# EasyEDA Pro project fm33fk5410_Topaz_v1.2.epro, schematic Schematic6

## Sheets
1 core: Board Name: core_3; Create Date: 2025-07-03; Page Name: core; Project Name: fm33; Schematic Name: Schematic6; Update Date: 2025-07-19; Company: 嘉立创EDA; Page Size: A4; Version: V1.0
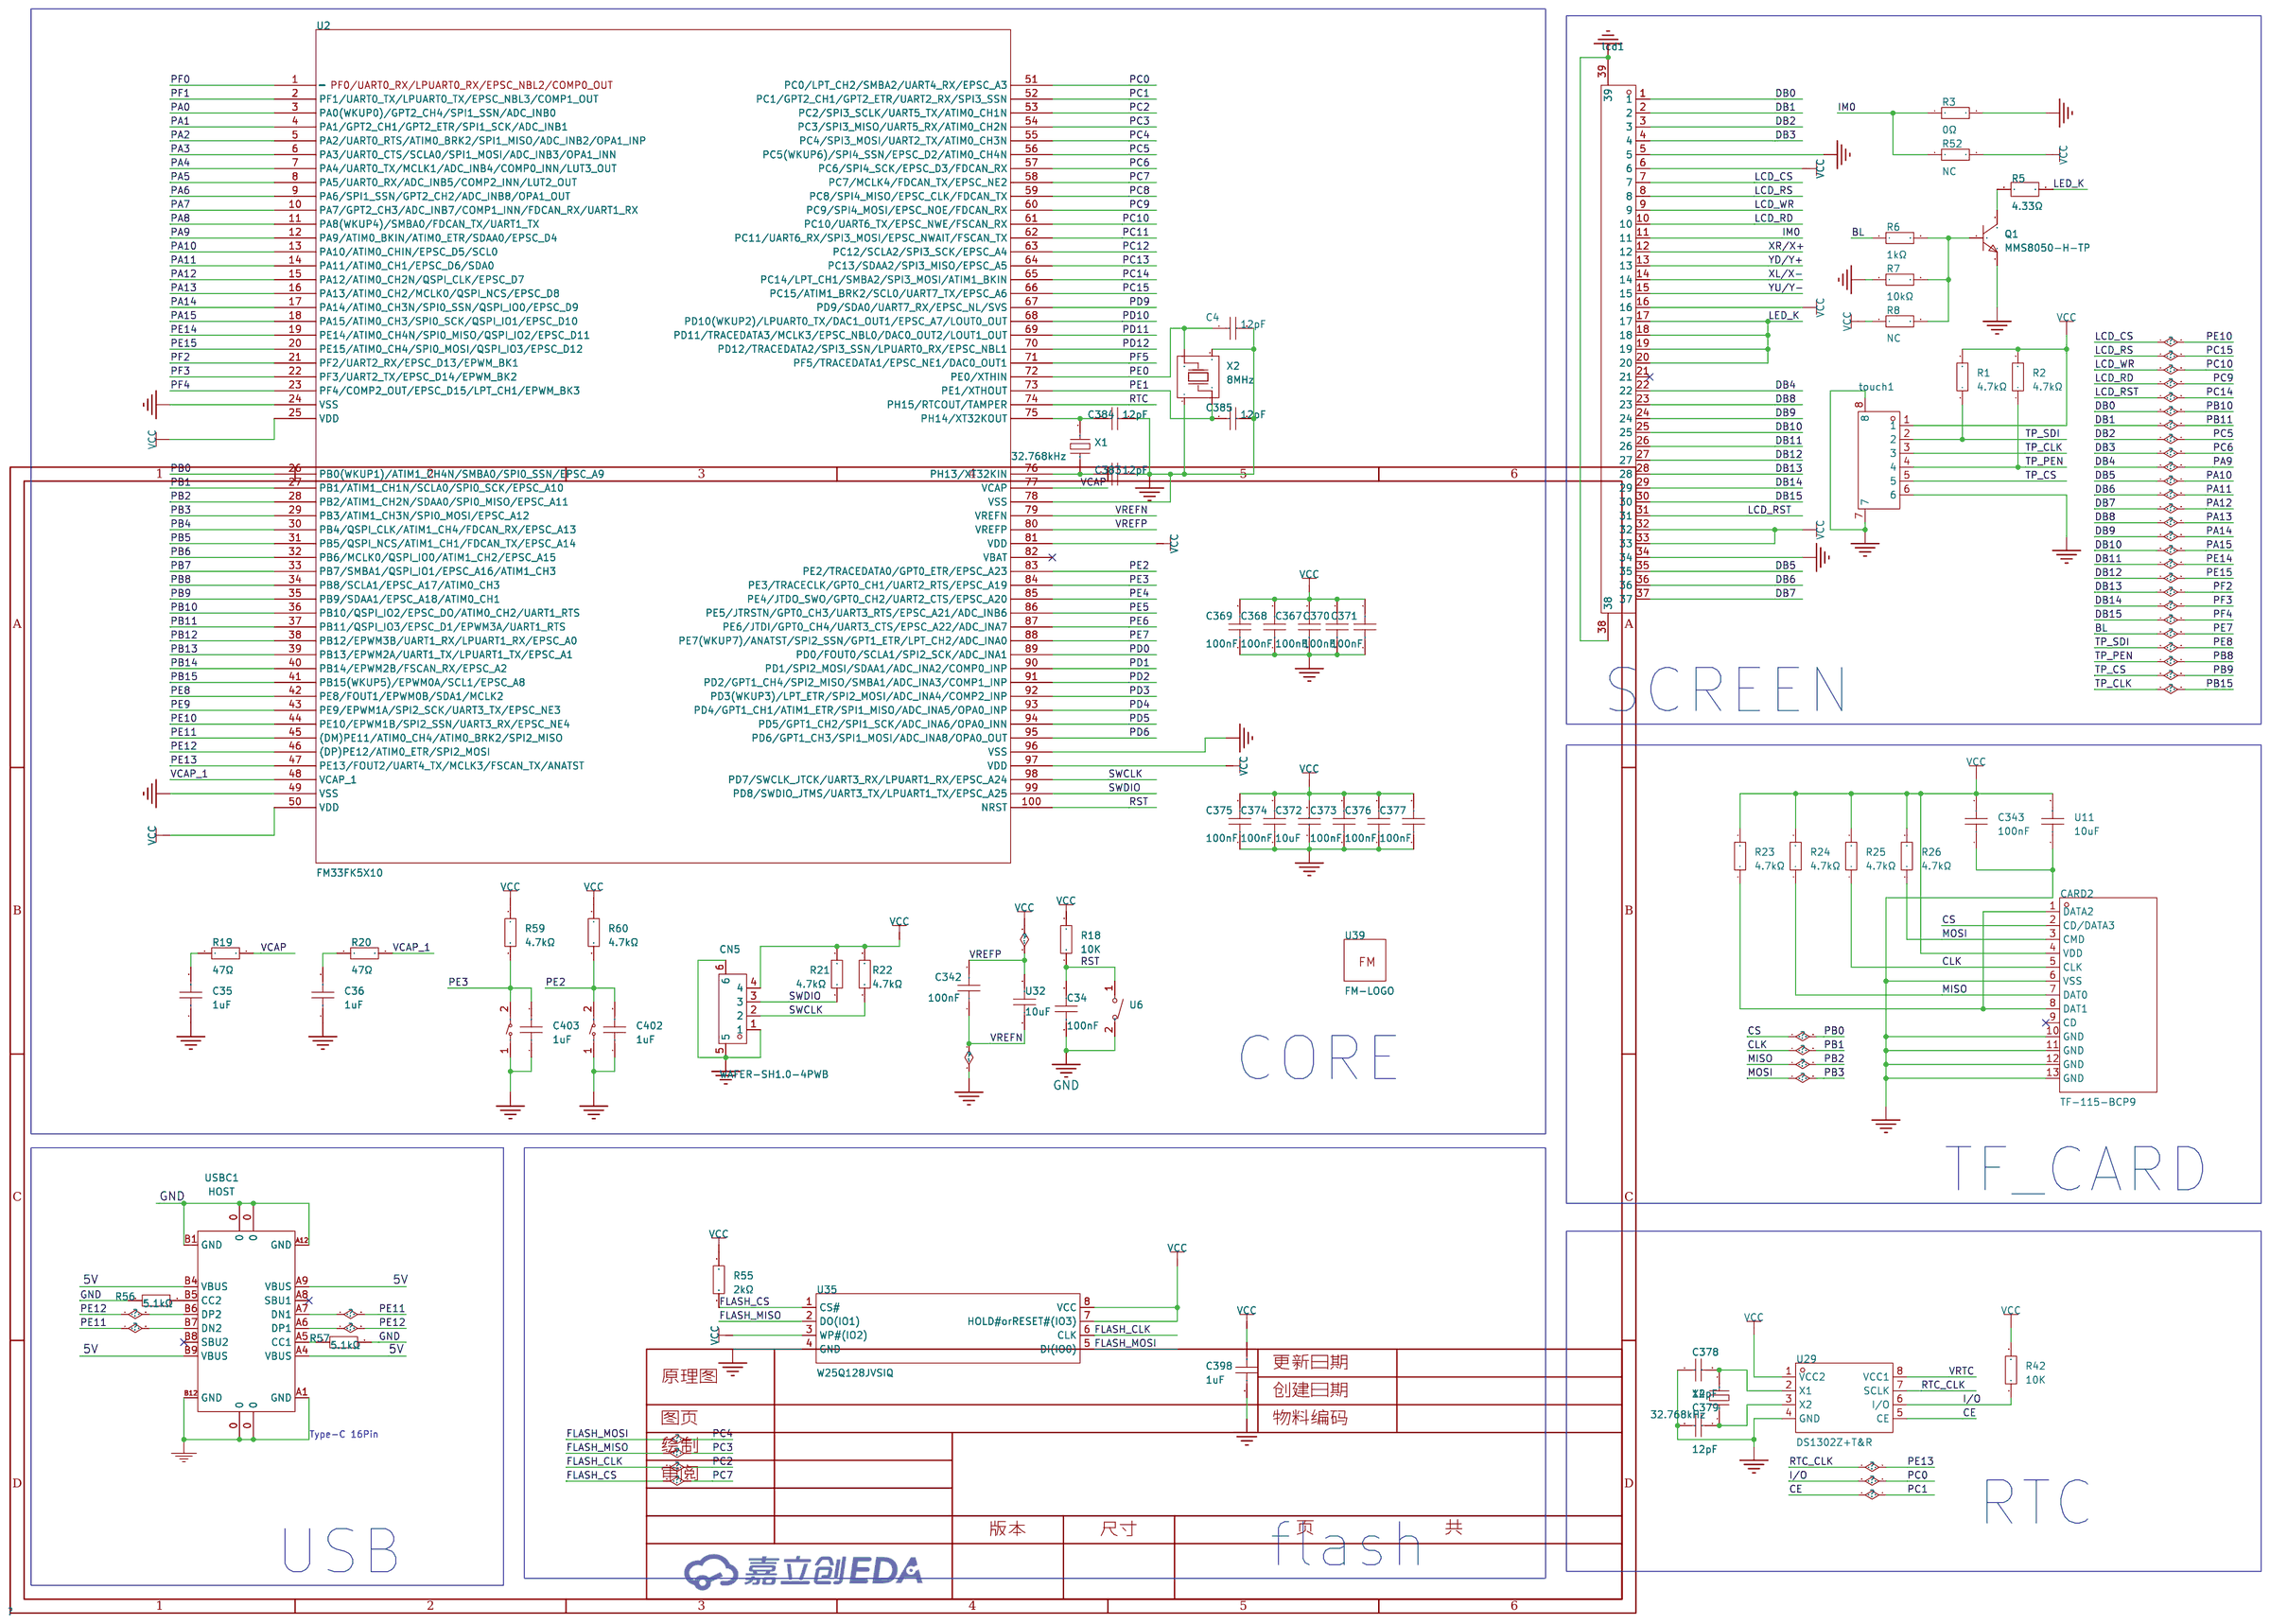
[diagram p0: core]
2 power: Create Date: 2025-07-15; Page Name: power; Update Date: 2025-07-18
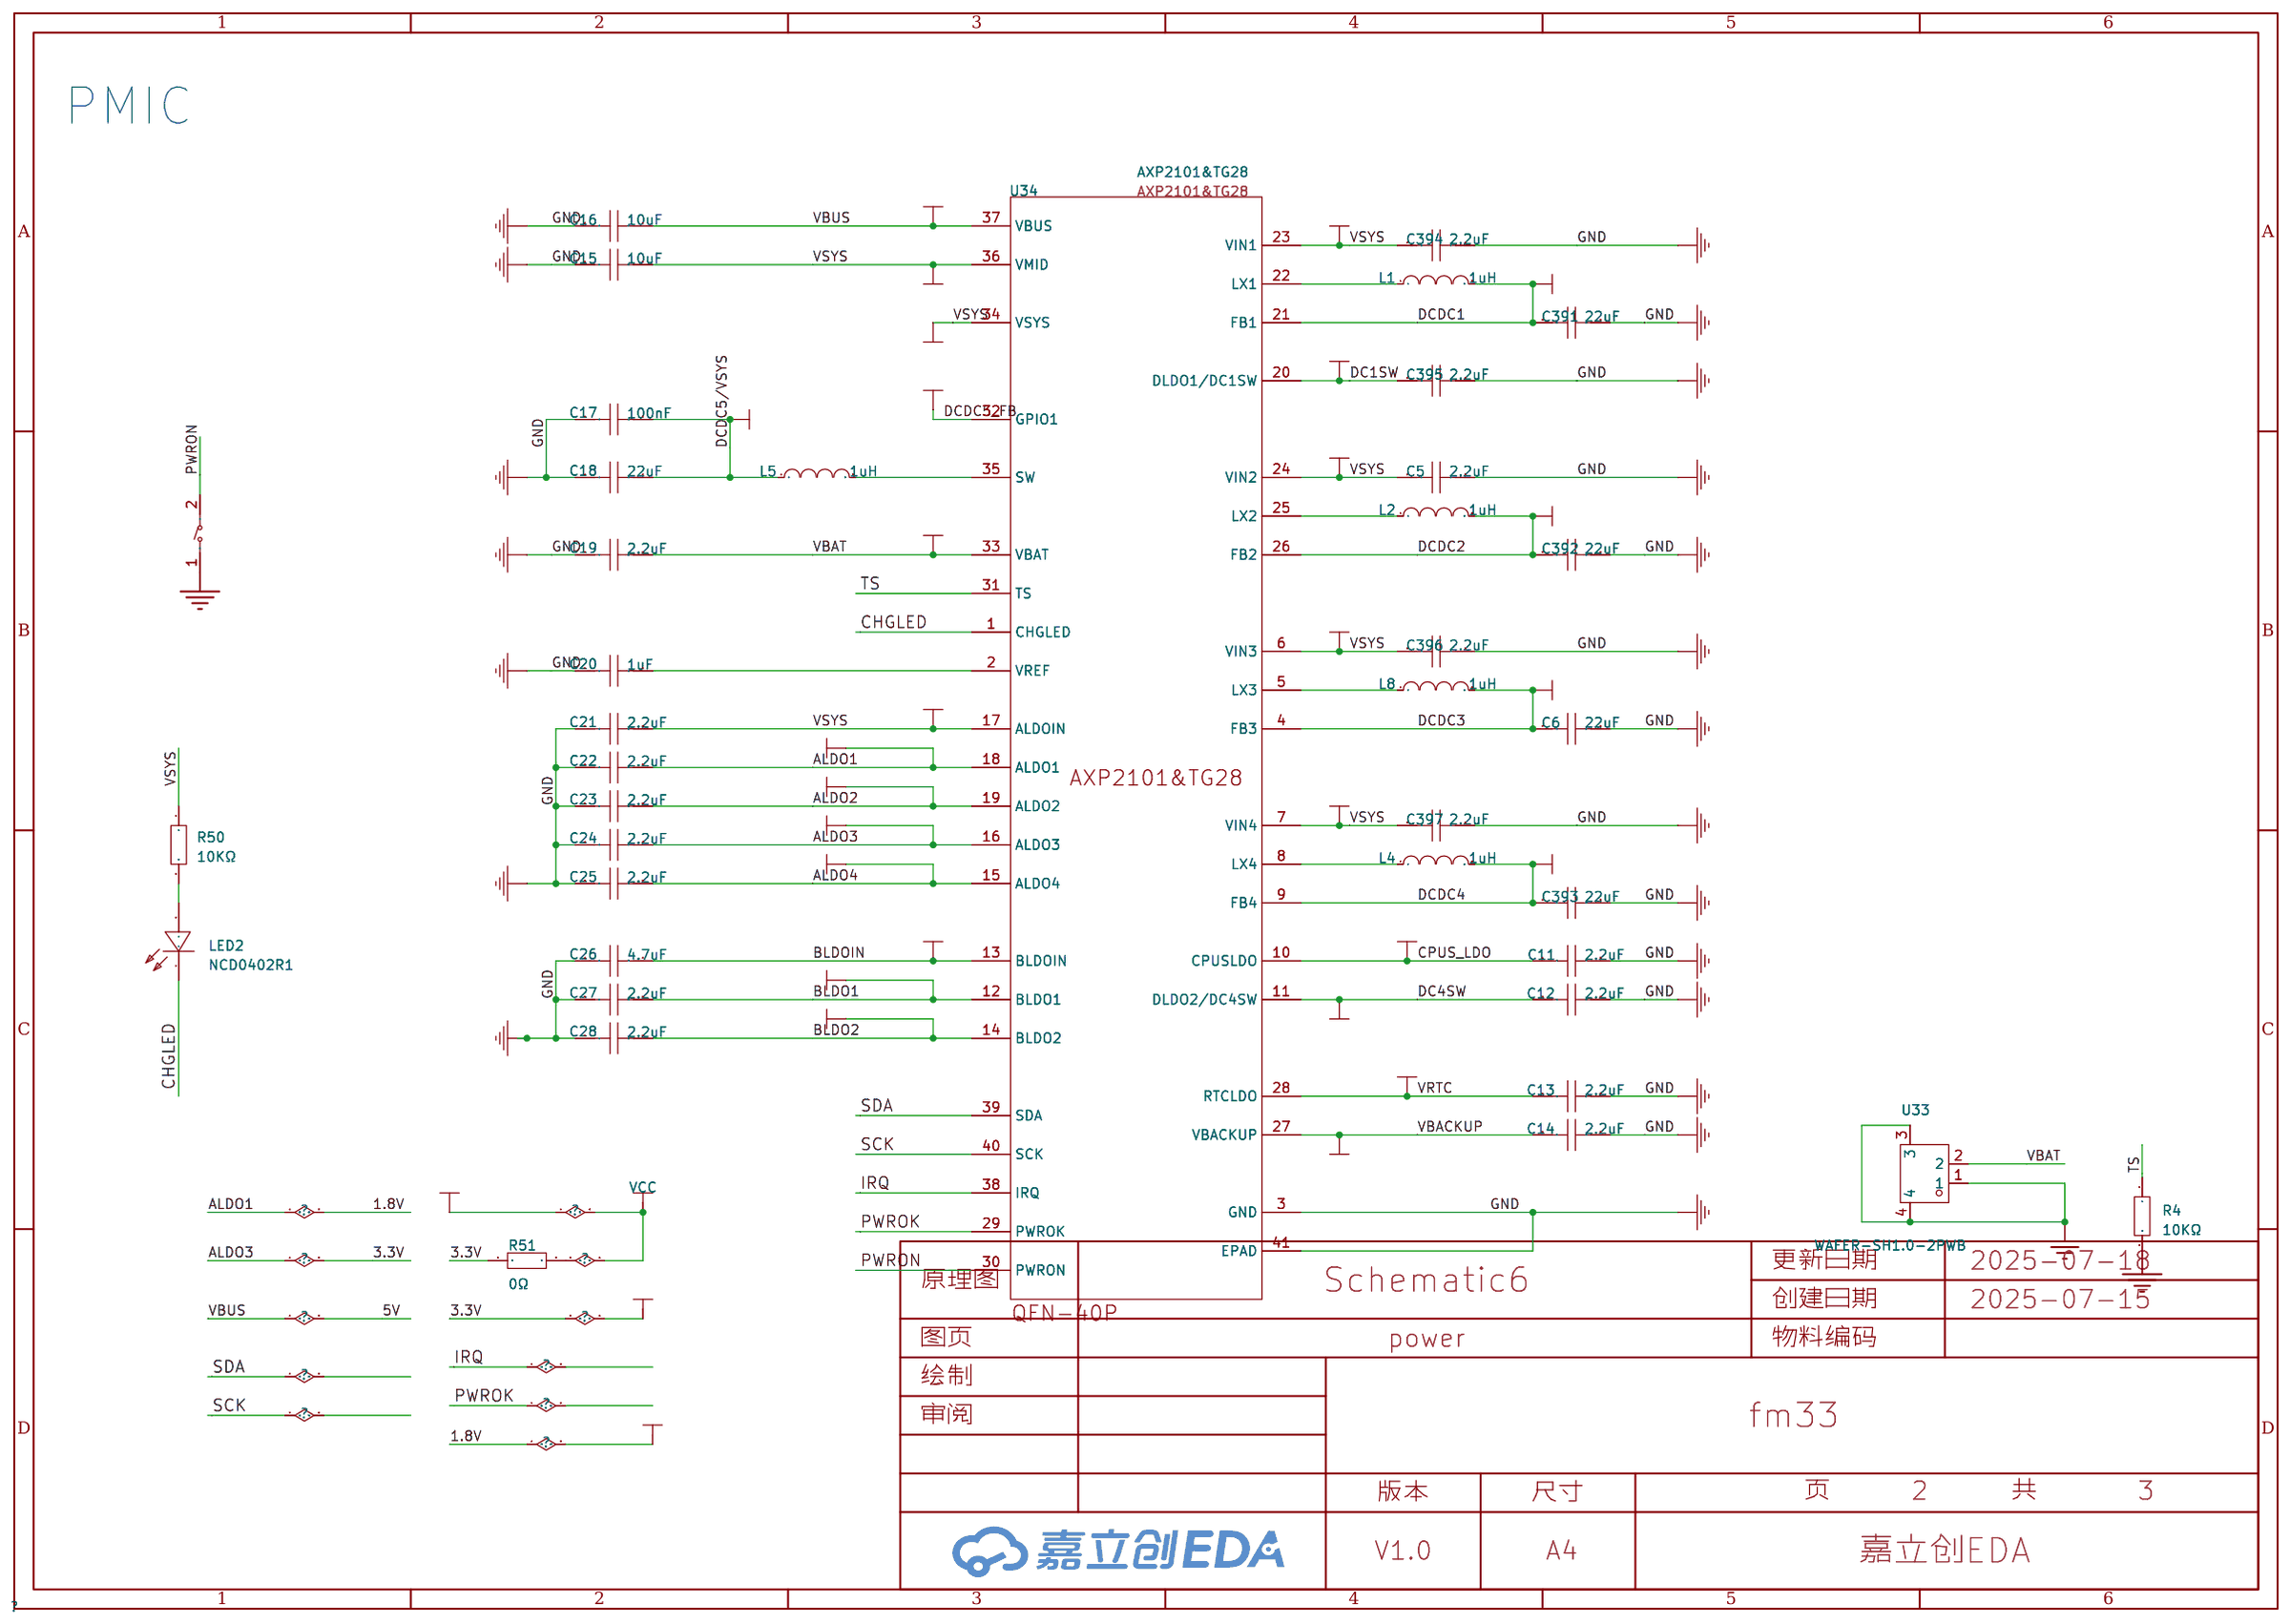
[diagram p1: power]
3 wav_decoder: Create Date: 2025-07-15; Page Name: wav_decoder
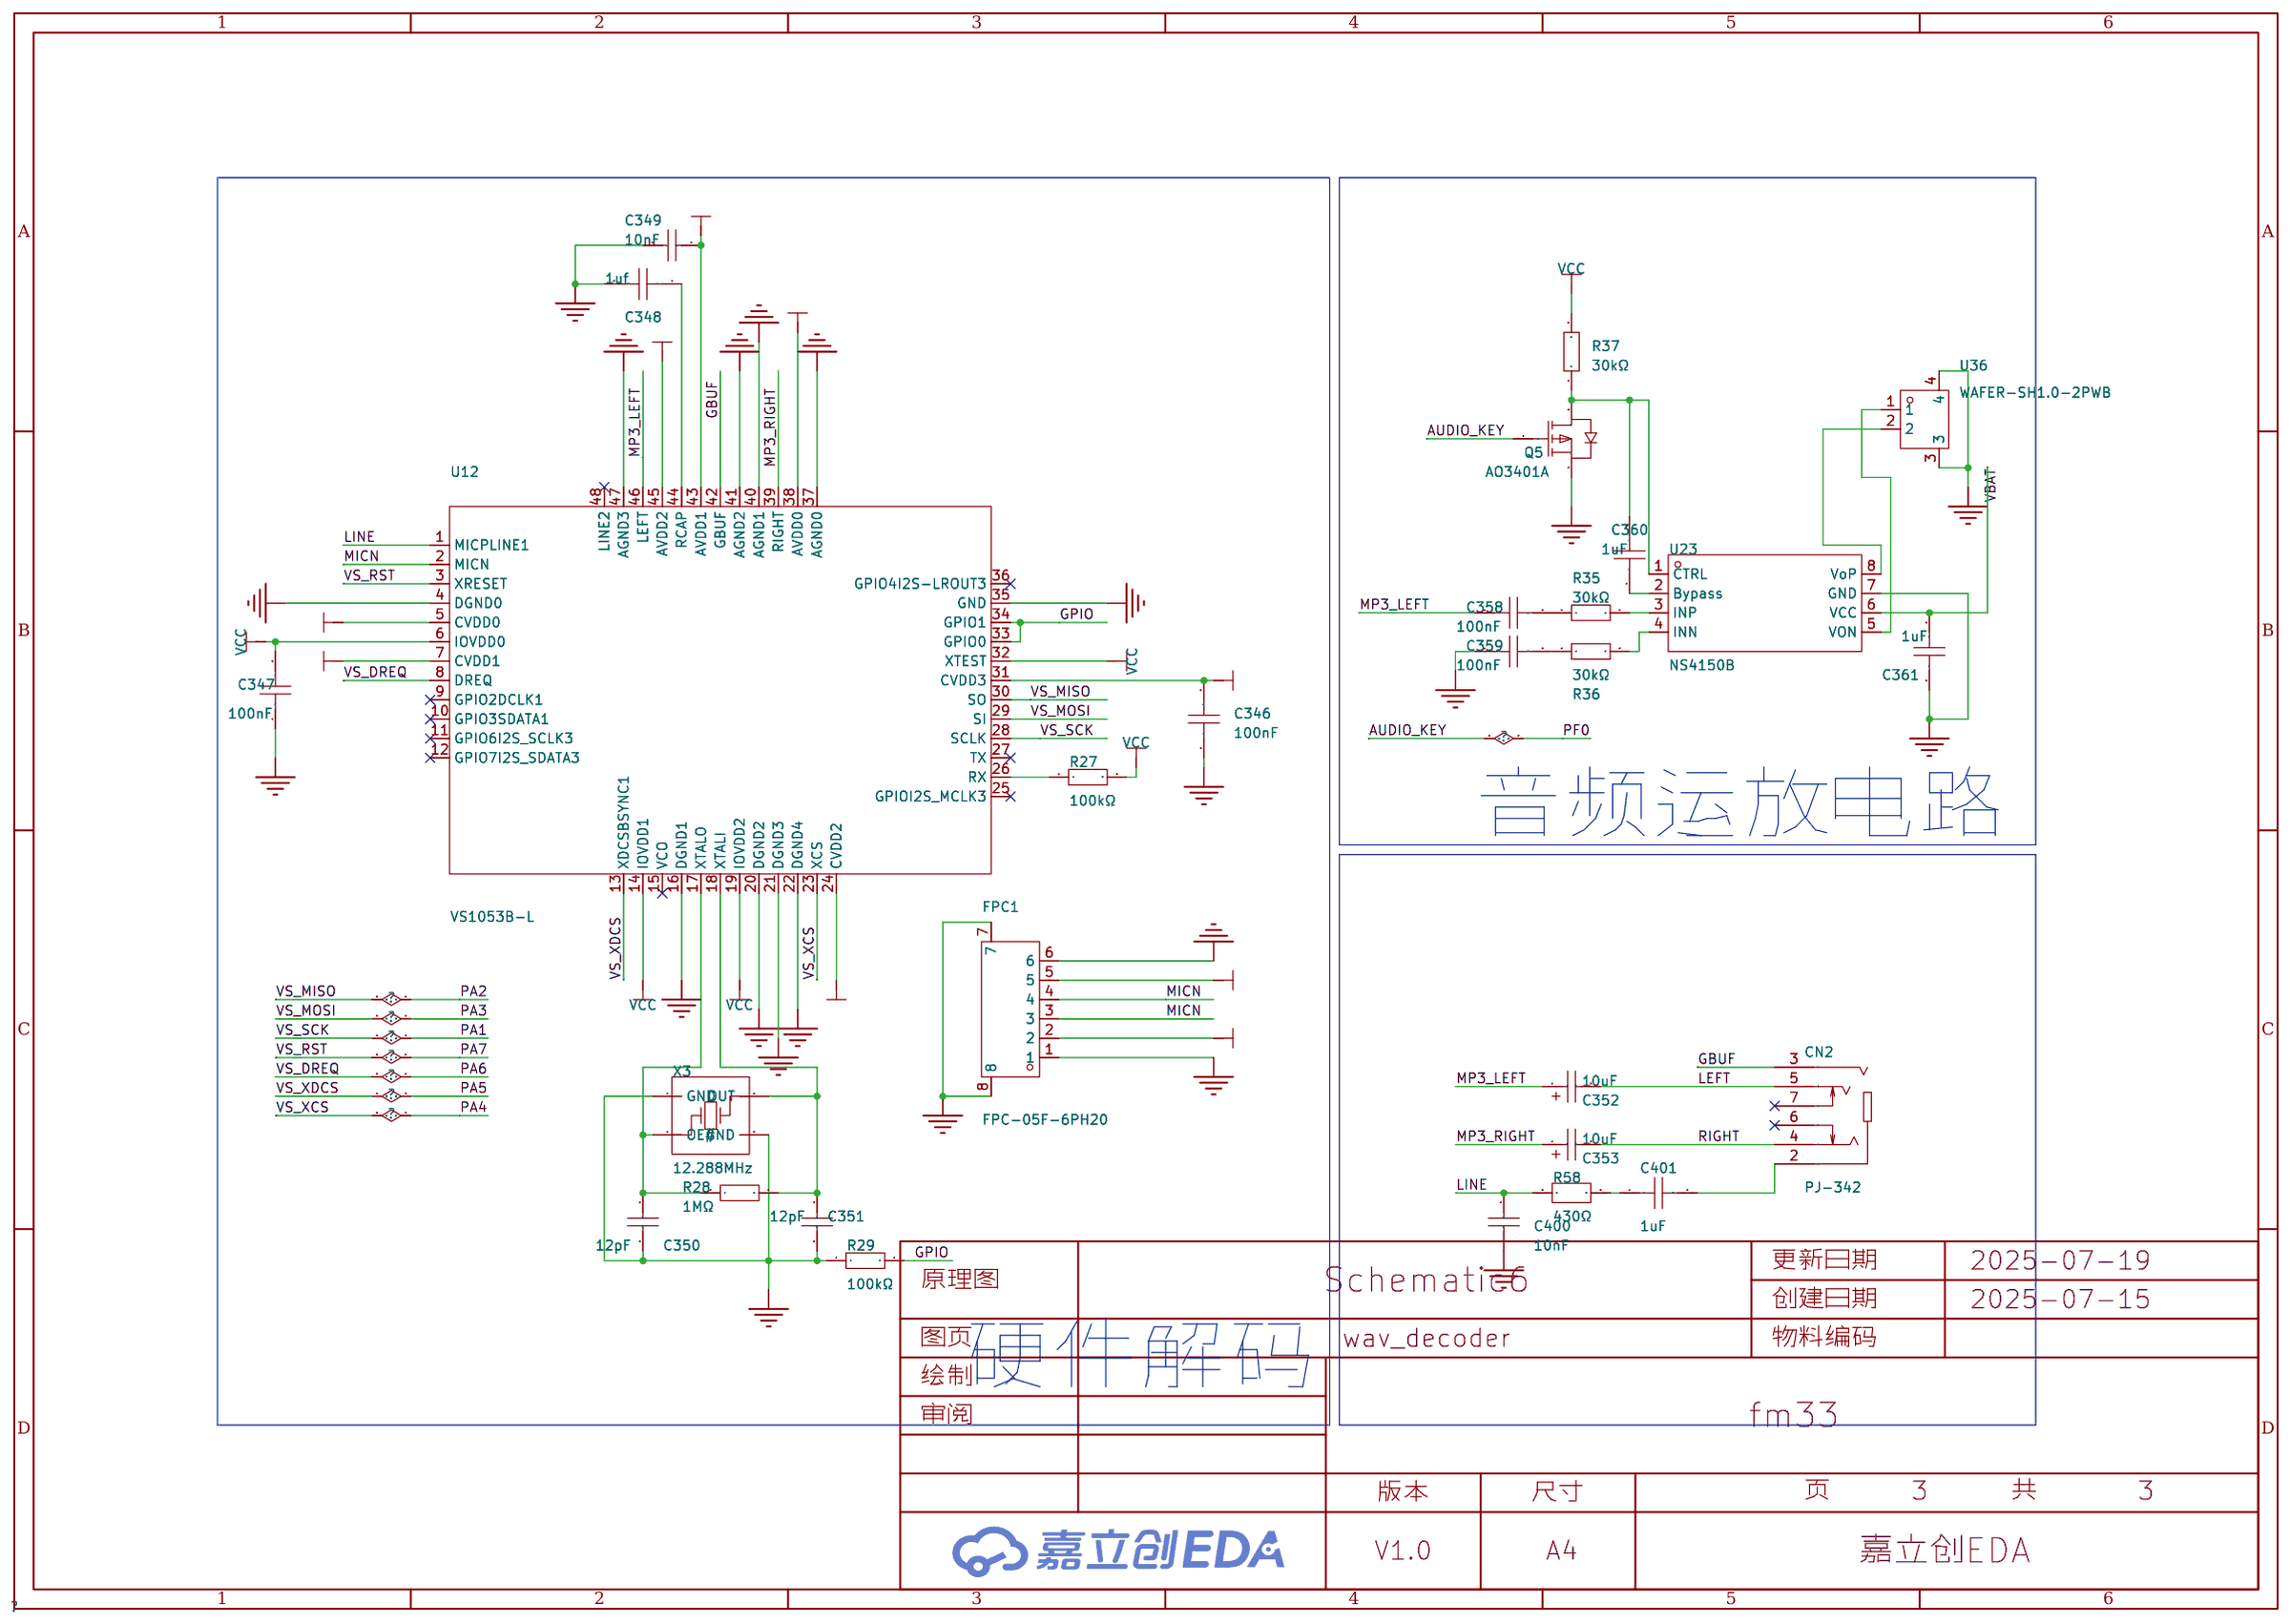
[diagram p2: wav_decoder]

## Parts
sheet core
C4  12pF  [C0402-NSK]
C34  100nF  [C0402-NSK]
C35  1uF  [C0402-NSK]
C36  1uF  [C0402-NSK]
C342  100nF  [C0402-NSK]
C343  100nF  [C0402-NSK]
C367  100nF  [C0402-NSK]
C368  100nF  [C0402-NSK]
C369  100nF  [C0402-NSK]
C370  100nF  [C0402-NSK]
C371  100nF  [C0402-NSK]
C372  10uF  [C0402-NSK]
C373  100nF  [C0402-NSK]
C374  100nF  [C0402-NSK]
C375  100nF  [C0402-NSK]
C376  100nF  [C0402-NSK]
C377  100nF  [C0402-NSK]
C378  12pF  [C0402-NSK]
C379  12pF  [C0402-NSK]
C383  12pF  [C0402-NSK]
C384  12pF  [C0402-NSK]
C385  12pF  [C0402-NSK]
C398  1uF  [C0603 NSK]
C402  1uF  [C0402-NSK]
C403  1uF  [C0402-NSK]
CARD2  TF-115-BCP9  [TF-SMD_TF-115-BCP9]
CN5  WAFER-SH1.0-4PWB  [CONN-SMD_4P-P1.00_WAFER-SH1.0-4PWB]
lcd1  KH-FG0.5-H2.0-37PIN  [FPC-SMD_37P-P0.50_KINGHELM_KH-FG0.5-H2.0-37PIN]
Q1  MMS8050-H-TP  [SOT-23-3_L2.9-W1.3-P1.90-LS2.4-BR]
R1  4.7kΩ  [R0402]
R2  4.7kΩ  [R0402]
R3  0Ω  [R0402]
R5  4.33Ω  [C0603]
R6  1kΩ  [R0402]
R7  10kΩ  [R0402]
R8  NC  [R0402]
R18  10K  [R0402]
R19  47Ω  [R0402]
R20  47Ω  [R0402]
R21  4.7kΩ  [R0402]
R22  4.7kΩ  [R0402]
R23  4.7kΩ  [R0402]
R24  4.7kΩ  [R0402]
R25  4.7kΩ  [R0402]
R26  4.7kΩ  [R0402]
R42  10K  [R0402]
R52  NC  [R0402]
R55  2kΩ  [R0402]
R56  5.1kΩ  [R0402]
R57  5.1kΩ  [R0402]
R59  4.7kΩ  [R0402]
R60  4.7kΩ  [R0402]
touch1  FPC-05F-6PH20  [FPC-SMD_6P-P0.50_XUNPU_FPC-05F-6PH20]
U2  FM33FK5X10  [LQFP100]
U6  TS2306A 200gf 002  [SW-SMD_L3.0-W2.0-LS3.5]
U11  10uF  [C0402-NSK]
U29  DS1302Z+T&R  [SOIC-8_L4.9-W3.9-P1.27-LS6.0-BL]
U32  10uF  [C0402-NSK]
U35  W25Q128JVSIQ  [SOIC-8_L5.3-W5.3-P1.27-LS8.0-BL]
U37  THAF09-AC-R  [KEY-SMD_L3.9-W2.9-P4.6-LS5.0-W3.6-EH]
U38  THAF09-AC-R  [KEY-SMD_L3.9-W2.9-P4.6-LS5.0-W3.6-EH]
U39  FM-LOGO  [FM-LOGO]
USBC1  HOST  [USB-TYPE-C_16PIN-MALE-TYPE-C-31-M-12]
X1  32.768kHz  [OSC-SMD_L3.2-W1.5]
X2  8MHz  [CRYSTAL-SMD_4P-L3.2-W2.5-BL]
X4  32.768kHz  [OSC-SMD_L3.2-W1.5]
sheet power
C5  2.2uF  [C0603]
C6  22uF  [C0603]
C11  2.2uF  [C0603]
C12  2.2uF  [C0603]
C13  2.2uF  [C0603]
C14  2.2uF  [C0603]
C15  10uF  [C0603]
C16  10uF  [C0603]
C17  100nF  [C0603]
C18  22uF  [C0603]
C19  2.2uF  [C0603]
C20  1uF  [C0603]
C21  2.2uF  [C0603]
C22  2.2uF  [C0603]
C23  2.2uF  [C0603]
C24  2.2uF  [C0603]
C25  2.2uF  [C0603]
C26  4.7uF  [C0603]
C27  2.2uF  [C0603]
C28  2.2uF  [C0603]
C391  22uF  [C0603]
C392  22uF  [C0603]
C393  22uF  [C0603]
C394  2.2uF  [C0603]
C395  2.2uF  [C0603]
C396  2.2uF  [C0603]
C397  2.2uF  [C0603]
L1  1uH  [L0806]
L2  1uH  [L0806]
L4  1uH  [L0806]
L5  1uH  [L0806]
L8  1uH  [L0806]
LED2  NCD0402R1  [LED0402-RD]
R4  10KΩ  [R0402]
R50  10KΩ  [R0402]
R51  0Ω  [C0603 NSK]
U10  THAF09-AC-R  [KEY-SMD_L3.9-W2.9-P4.6-LS5.0-W3.6-EH]
U33  WAFER-SH1.0-2PWB  [CONN-SMD_2P-P1.00_XUNPU_WAFER-SH1.0-2PWB]
U34  AXP2101&TG28  [QFN-40_L5.0-W5.0-P0.40-TL-EP3.4]
sheet wav_decoder
C346  100nF  [C0402-NSK]
C347  100nF  [C0402-NSK]
C348  1uf  [C0402-NSK]
C349  10nF  [C0402-NSK]
C350  12pF  [C0402-NSK]
C351  12pF  [C0402-NSK]
C352  10uF  [CAP-SMD_L3.2-W1.6-RD-C7171]
C353  10uF  [CAP-SMD_L3.2-W1.6-RD-C7171]
C358  100nF  [C0402-NSK]
C359  100nF  [C0402-NSK]
C360  1uF  [C0402-NSK]
C361  1uF  [C0402-NSK]
C400  10nF  [C0402-NSK]
C401  1uF  [C0402-NSK]
CN2  PJ-342  [AUDIO-SMD_PJ-342]
FPC1  FPC-05F-6PH20  [FPC-SMD_6P-P0.50_XUNPU_FPC-05F-6PH20]
Q5  AO3401A  [SOT-23_L2.9-W1.3-P1.90-LS2.4-BR]
R27  100kΩ  [R0402]
R28  1MΩ  [R0402]
R29  100kΩ  [R0402]
R35  30kΩ  [R0402]
R36  30kΩ  [R0402]
R37  30kΩ  [R0402]
R58  430Ω  [R0402]
U12  VS1053B-L  [LQFP-48_L7.0-W7.0-P0.50-LS9.0-BL]
U23  NS4150B  [MSOP-8_L3.0-W3.0-P0.65-LS5.0-BL]
U36  WAFER-SH1.0-2PWB  [CONN-SMD_2P-P1.00_XUNPU_WAFER-SH1.0-2PWB]
X3  12.288MHz  [CRYSTAL-SMD_4P-L3.2-W2.5-BL-2]

## Library data of the parts
C4 C350 C351 C378 C379 C383-C385 = GRM1555C1H120JA01D: 容值:12pF;精度:±5%;额定电压:50V;材质(温度系数):C0G;; LCSC Part Name: 12pF ±5% 50V; Supplier Part: C76948; Manufacturer: muRata(村田); Supplier Footprint: 0402; JLCPCB Part Class: 扩展库; Datasheet: https://atta.szlcsc.com/upload/public/pdf/source/20180307/C76948_15204091175261407736.pdf; Supplier: LCSC; Tolerance: ±5%; Voltage Rated: 50V; Temperature Coefficient: C0G
C34 C346-C348 = CAP_0402: Supplier Footprint: 0402
C35 C36 C360 C361 C401-C403 = CL05A105KA5NQNC: 容值:1uF;精度:±10%;额定电压:25V;材质(温度系数):X5R;; LCSC Part Name: 1uF ±10% 25V; Supplier Part: C52923; Manufacturer: SAMSUNG(三星); Supplier Footprint: 0402; JLCPCB Part Class: 基础库; Datasheet: https://atta.szlcsc.com/upload/public/pdf/source/20160218/1457707763339.pdf; Supplier: LCSC; Tolerance: ±10%; Voltage Rated: 25V; Temperature Coefficient: X5R
C342 C343 C358 C359 C367-C371 C373-C377 = CL05B104KB54PNC: 容值:100nF;精度:±10%;额定电压:50V;材质(温度系数):X7R;; LCSC Part Name: 100nF ±10% 50V; Supplier Part: C307331; Manufacturer: SAMSUNG(三星); Supplier Footprint: 0402; JLCPCB Part Class: 基础库; Datasheet: https://atta.szlcsc.com/upload/public/pdf/source/20160218/1457707763339.pdf; Supplier: LCSC; Tolerance: ±10%; Voltage Rated: 50V; Temperature Coefficient: X7R
C372 = CL05A106MQ5NUNC: 容值:10uF;精度:±20%;额定电压:6.3V;材质(温度系数):X5R;; LCSC Part Name: 10uF ±20% 6.3V; Supplier Part: C15525; Manufacturer: SAMSUNG(三星); Supplier Footprint: 0402; JLCPCB Part Class: 基础库; Datasheet: https://atta.szlcsc.com/upload/public/pdf/source/20220823/2B02EE04F8F211D38A52DCB16EB6BEBA.pdf; Supplier: LCSC; Tolerance: ±20%; Voltage Rated: 6.3V; Temperature Coefficient: X5R
C398 = CL10A105KB8NNNC: 容值:1uF;精度:±10%;额定电压:50V;材质(温度系数):X5R;; LCSC Part Name: 1uF ±10% 50V; Supplier Part: C15849; Manufacturer: SAMSUNG(三星); Supplier Footprint: 0603; JLCPCB Part Class: 基础库; Datasheet: https://atta.szlcsc.com/upload/public/pdf/source/20160218/1457707763339.pdf; Supplier: LCSC; Tolerance: ±10%; Voltage Rated: 50V; Temperature Coefficient: X5R
CARD2 = TF-115-BCP9: 卡连接方式:自弹式;卡类型:MicroSD卡(TF卡);连接器类型:卡座;本体最大高度:1.8mm;工作温度范围:-25℃~+85℃;; LCSC Part Name: 自弹式 MicroSD卡(TF卡) 卡座; Supplier Part: C720505; Manufacturer: XUNPU(讯普); Supplier Footprint: SMD; JLCPCB Part Class: 扩展库; Datasheet: https://atta.szlcsc.com/upload/public/pdf/source/20210906/DBEC8F03AA1503572333C7CF4A76D0AD.pdf; Supplier: LCSC; Card Connection Mode: 自弹式; Card Type: MicroSD卡(TF卡); Connector Type: 卡座; Maximum Body Height: 1.8mm; Operating Temperature Range: -25℃~+85℃
CN5 = WAFER-SH1.0-4PWB: 插针结构:1x4P;间距:1mm;安装方式:卧贴;参考系列:SH;总PIN数:4P;排数:1;每排PIN数:4;行距:-;额定电流:1A;触头材质:黄铜;触头镀层:-;工作温度:-25℃~+85℃;; LCSC Part Name: 1x4P 间距:1mm 卧贴 系列:SH; Supplier Part: C3029343; Manufacturer: XUNPU(讯普); Supplier Footprint: SMD,P=1mm,卧贴; JLCPCB Part Class: 扩展库; Datasheet: https://atta.szlcsc.com/upload/public/pdf/source/20220527/1879B8210BD3B2006BCEAC1A40D397B6.pdf; Supplier: LCSC; Pins Structure: 1x4P; Pitch: 1mm; Mounting Type: 卧贴; Reference Series: SH; Number of Pins: 4P; Number of Rows: 1; Number of PINs Per Row: 4; Current Rating: 1A; Contact Material: 黄铜; Operating Temperature: -25℃~+85℃; Voltage Rating: 50V; Plastic Material: LCP; Supplementary Features: 辅助焊脚; Color: 米色; Z-Height of the Board: 3.15mm; X-Length of Bottom Edge on Board (Spacing Line): 6.35mm; Y-Width of Bottom Edge on Board: 5.05mm
lcd1 = KH-FG0.5-H2.0-37PIN: 锁定特性:翻盖式;触点类型:下接;触点数量:37P;间距:0.5mm;安装类型:卧贴;工作温度范围:-25℃~+85℃;; LCSC Part Name: 间距:0.5mm P数:37P 翻盖式 下接; Supplier Part: C2932714; Manufacturer: kinghelm(金航标); Supplier Footprint: SMD,P=0.5mm,卧贴; JLCPCB Part Class: 扩展库; Datasheet: https://atta.szlcsc.com/upload/public/pdf/source/20211220/D9DEE2565E0E845A2D69A78DEAE13B4D.pdf; Supplier: LCSC; Locking Feature: 翻盖式; Contact Type: 下接; Number of Contacts: 37P; Pitch: 0.5mm; Mounting Type: 卧贴; FFC, FCB Thickness: 0.3mm; Height Above Board: 2mm; Operating Temperature Range: -25℃~+85℃
Q1 = MMS8050-H-TP: 晶体管类型:NPN;集电极电流(Ic):500mA;集射极击穿电压(Vceo):25V;耗散功率(Pd):300mW;直流电流增益(hFE):120@50mA,1V;; Supplier Part: C668971; Manufacturer: MCC(美微科); Supplier Footprint: SOT-23; JLCPCB Part Class: 扩展库; Datasheet: https://atta.szlcsc.com/upload/public/pdf/source/20200618/C668971_E8C4278A0C61D2294D468F2197C24659.pdf; Supplier: LCSC; type: NPN; Current - Collector(Ic): 500mA; Collector - Emitter Voltage VCEO: 25V; Pd - Power Dissipation: 300mW; DC Current Gain: 120@50mA,1V; Transition frequency(fT): 150MHz; Current - Collector Cutoff: 100nA; Vce Saturation(VCE(sat)): 600mV; Operating Temperature: -55℃~+150℃@(Tj)
R1 R2 R7 R8 R23-R26 R59 R60 = 0402WGF1002TCE: 电阻类型:厚膜电阻;阻值:10kΩ;精度:±1%;功率:62.5mW;最大工作电压:50V;温度系数:±100ppm/℃;; LCSC Part Name: 10kΩ ±1% 62.5mW 厚膜电阻; Supplier Part: C25744; Manufacturer: UNI-ROYAL(厚声); Supplier Footprint: 0402; JLCPCB Part Class: 基础库; Datasheet: https://atta.szlcsc.com/upload/public/pdf/source/20200306/C422600_1E6D84923E4A46A82E41ADD87F860B5C.pdf; Supplier: LCSC; Type: 厚膜电阻; Tolerance: ±1%; Power(Watts): 62.5mW; Overload Voltage (Max): 50V; Temperature Coefficient: ±100ppm/℃; Operating Temperature Range: -55℃~+155℃
R3 R52 = 0402WGF0000TCE: 电阻类型:厚膜电阻;阻值:0Ω;精度:±1%;功率:62.5mW;最大工作电压:50V;温度系数:±800ppm/℃;; LCSC Part Name: 0Ω ±1% 62.5mW 厚膜电阻; Supplier Part: C17168; Manufacturer: UNI-ROYAL(厚声); Supplier Footprint: 0402; JLCPCB Part Class: 基础库; Datasheet: https://atta.szlcsc.com/upload/public/pdf/source/20200306/C422600_1E6D84923E4A46A82E41ADD87F860B5C.pdf; Supplier: LCSC; Type: 厚膜电阻; Tolerance: ±1%; Power(Watts): 62.5mW; Overload Voltage (Max): 50V; Temperature Coefficient: ±800ppm/℃; Operating Temperature Range: -55℃~+155℃
R5 = CR164R33F: 电阻类型:厚膜电阻;阻值:4.33Ω;精度:±1%;功率:100mW;温度系数:±200ppm/℃;; LCSC Part Name: 厚膜电阻 4.33Ω ±1% 100mW; Supplier Part: C4144169; Manufacturer: Meritek; Supplier Footprint: 0603; JLCPCB Part Class: 扩展库; Datasheet: https://atta.szlcsc.com/upload/public/pdf/source/20240408/EFC32A6E0B04D07E4D8A435A440C47B4.pdf; Supplier: LCSC; Type: 厚膜电阻; Tolerance: ±1%; Power(Watts): 100mW; Temperature Coefficient: ±200ppm/℃; Operating Temperature: -55℃~+155℃
R6 = 0402WGF1001TCE: 电阻类型:厚膜电阻;阻值:1kΩ;精度:±1%;功率:62.5mW;最大工作电压:50V;温度系数:±100ppm/℃;; LCSC Part Name: 1kΩ ±1% 62.5mW 厚膜电阻; Supplier Part: C11702; Manufacturer: UNI-ROYAL(厚声); Supplier Footprint: 0402; JLCPCB Part Class: 基础库; Datasheet: https://atta.szlcsc.com/upload/public/pdf/source/20200306/C422600_1E6D84923E4A46A82E41ADD87F860B5C.pdf; Supplier: LCSC; Type: 厚膜电阻; Tolerance: ±1%; Power(Watts): 62.5mW; Overload Voltage (Max): 50V; Temperature Coefficient: ±100ppm/℃; Operating Temperature Range: -55℃~+155℃
R18 R42 = Res_0402: Supplier Footprint: 0402
R19 R20 = RC0402FR-0747RL: 电阻类型:厚膜电阻;阻值:47Ω;精度:±1%;功率:62.5mW;最大工作电压:50V;温度系数:±100ppm/℃;; LCSC Part Name: 厚膜电阻 47Ω ±1% 62.5mW; Supplier Part: C137973; Manufacturer: YAGEO(国巨); Supplier Footprint: 0402; JLCPCB Part Class: 扩展库; Datasheet: https://atta.szlcsc.com/upload/public/pdf/source/20181009/C309620_DA5935B6E1D48212CB7A533FE518B3C2.pdf; Supplier: LCSC; Type: 厚膜电阻; Tolerance: ±1%; Power(Watts): 62.5mW; Overload Voltage (Max): 50V; Temperature Coefficient: ±100ppm/℃; Operating Temperature Range: -55℃~+155℃
R21 R22 = 0402WGF4701TCE: 电阻类型:厚膜电阻;阻值:4.7kΩ;精度:±1%;功率:62.5mW;最大工作电压:50V;温度系数:±100ppm/℃;; LCSC Part Name: 4.7kΩ ±1% 62.5mW 厚膜电阻; Supplier Part: C25900; Manufacturer: UNI-ROYAL(厚声); Supplier Footprint: 0402; JLCPCB Part Class: 基础库; Datasheet: https://atta.szlcsc.com/upload/public/pdf/source/20200306/C422600_1E6D84923E4A46A82E41ADD87F860B5C.pdf; Supplier: LCSC; Type: 厚膜电阻; Tolerance: ±1%; Power(Watts): 62.5mW; Overload Voltage (Max): 50V; Temperature Coefficient: ±100ppm/℃; Operating Temperature Range: -55℃~+155℃
R55-R57 = 0402WGF5101TCE: 电阻类型:厚膜电阻;阻值:5.1kΩ;精度:±1%;功率:62.5mW;最大工作电压:50V;温度系数:±100ppm/℃;; LCSC Part Name: 5.1kΩ ±1% 62.5mW 厚膜电阻; Supplier Part: C25905; Manufacturer: UNI-ROYAL(厚声); Supplier Footprint: 0402; JLCPCB Part Class: 基础库; Datasheet: https://atta.szlcsc.com/upload/public/pdf/source/20200306/C422600_1E6D84923E4A46A82E41ADD87F860B5C.pdf; Supplier: LCSC; Type: 厚膜电阻; Tolerance: ±1%; Power(Watts): 62.5mW; Overload Voltage (Max): 50V; Temperature Coefficient: ±100ppm/℃; Operating Temperature Range: -55℃~+155℃
FPC1 touch1 = FPC-05F-6PH20: 锁定特性:翻盖式;触点类型:下接;触点数量:6P;间距:0.5mm;安装类型:卧贴;工作温度范围:-25℃~+85℃;; LCSC Part Name: 间距:0.5mm P数:6P 翻盖式 下接; Supplier Part: C2856796; Manufacturer: XUNPU(讯普); Supplier Footprint: SMD,P=0.5mm,卧贴; JLCPCB Part Class: 扩展库; Datasheet: https://atta.szlcsc.com/upload/public/pdf/source/20210922/16B003FB53336DDF6538142CC465AC4D.pdf; Supplier: LCSC; Locking Feature: 翻盖式; Contact Type: 下接; Number of Contacts: 6P; Pitch: 0.5mm; Mounting Type: 卧贴; FFC, FCB Thickness: 0.3mm; Height Above Board: 2mm; Operating Temperature Range: -25℃~+85℃
U2 = FM33FK5X10
U6 = TS2306A 200gf 002: 电路结构:单刀单掷;按钮形状:圆形按钮;作用力:200gf;安装方式:立贴;开关长度:3mm;开关宽度:2mm;开关高度:0.6mm;带支架:不带;触点电流:50mA;额定电压(DC):5V;额定功率:0.25W;绝缘电阻:100MΩ;带灯:无;机械寿命:30万次;; LCSC Part Name: 薄膜开关 2*3*0.6mm 蓝牙耳机/开机按键 两脚 黄膜黑点 200gf; Supplier Part: C5363482; Manufacturer: SHOU HAN(首韩); Supplier Footprint: SMD; Datasheet: https://atta.szlcsc.com/upload/public/pdf/source/20230321/144662D432400ADC228EB2A996730BBD.pdf; Supplier: LCSC; Circuit: 单刀单掷; Actuator Style: 圆形按钮; Operating Force: 200gf; Mounting Style: 立贴; Switch Length: 3mm; Switch Width: 2mm; Switch Height: 0.6mm; Strike Gundam: 不带; Contact Current: 50mA; Voltage Rating (DC): 5V; Power Rating: 0.25W; Insulation Resistance: 100MΩ; Actuator/Cap Color: 黄色; With Lamp: 无; Mechanical Life: 30万次; Operating Temperature: -40℃~+80℃
U11 U32 = HGC0402R5106M100NTEJ: 容值:10uF;精度:±20%;额定电压:10V;材质(温度系数):X5R;; LCSC Part Name: 10uF ±20% 10V; Supplier Part: C7472949; Manufacturer: Chinocera(华瓷); Supplier Footprint: 0402; JLCPCB Part Class: 扩展库; Datasheet: https://atta.szlcsc.com/upload/public/pdf/source/20240320/FAC3FEC40A78BC5CCCE96C232A94D860.pdf; Supplier: LCSC; Tolerance: ±20%; Voltage Rated: 10V; Temperature Coefficient: X5R
U29 = DS1302Z+T&R: 接口:SPI;; LCSC Part Name: 带涓流充电的时钟芯片; Supplier Part: C8959; Manufacturer: ADI(亚德诺)/MAXIM(美信); Supplier Footprint: SOIC-8; JLCPCB Part Class: 扩展库; Datasheet: https://atta.szlcsc.com/upload/public/pdf/source/20130705/1457706621880.pdf; Supplier: LCSC; Interface: SPI; Operating Voltage: 2V~5.5V; Operating Temperature: 0℃~+70℃
U35 = W25Q128JVSIQ_C113767: 接口类型:SPI;存储容量:-;时钟频率(fc):133MHz;; Supplier Part: C113767; Manufacturer: Winbond(华邦); Supplier Footprint: SOIC-8-208mil; JLCPCB Part Class: 扩展库; Datasheet: https://atta.szlcsc.com/upload/public/pdf/source/20180329/C113767_097B64D788F6E3FFB2E9CB46CB6C1427.pdf; Supplier: LCSC; Interface: SPI; Clock Frequency: 133MHz; Voltage - Supply: 2.7V~3.6V; Program / Erase Cycles: 100000次; Page Programming Time (Tpp): 3ms
U10 U37 U38 = THAF09-AC-R: 按钮形状:方形按钮;作用力:250gf;开关长度:2.9mm;开关宽度:3.9mm;开关高度:1.5mm;带支架:不带;触点电流:50mA;额定电压(AC):250V;额定电压(DC):12V;绝缘电阻:100mΩ;带灯:无;机械寿命:5万次;; LCSC Part Name: 小龟侧按/平脚/1.5H/250gf/全黑/带柱/编带; Supplier Part: C19271013; Manufacturer: jianfu(键富); Supplier Footprint: SMD,2.9x3.9mm; Datasheet: https://atta.szlcsc.com/upload/public/pdf/source/20231201/133FC3E112BE3CDB70DBD3FBB89BD93C.pdf; Supplier: LCSC; Actuator Style: 方形按钮; Operating Force: 250gf; Switch Length: 2.9mm; Switch Width: 3.9mm; Switch Height: 1.5mm; Strike Gundam: 不带; Contact Current: 50mA; Voltage Rating (AC): 250V; Voltage Rating (DC): 12V; Insulation Resistance: 100mΩ; Actuator/Cap Color: 黑色; With Lamp: 无; Pin Style: SMD接片; Mechanical Life: 5万次; Operating Temperature: -40℃~+85℃
U39 = FM-LOGO
USBC1 = HOST
X1 X4 = X321532768KGD2SI: 晶振类型:贴片晶振;频率:32.768kHz;常温频差:±20ppm;外接负载电容:12.5pF;频率稳定度(全温):-;; LCSC Part Name: 32.768kHz ±20ppm 12.5pF; Supplier Part: C620155; Manufacturer: YXC(扬兴晶振); Supplier Footprint: SMD3215-2P; JLCPCB Part Class: 扩展库; Datasheet: https://atta.szlcsc.com/upload/public/pdf/source/20240329/3A7650FD985DD0DE85694D3785AB4916.pdf; Supplier: LCSC; Crystal Type: 贴片晶振; Normal temperature Frequency Tolerance: ±20ppm; External load capacitor: 12.5pF; Operating Temperature: -40℃~+85℃
X2 = TAXM8M4RDBCCT2T: 晶振类型:贴片晶振;频率:8MHz;常温频差:±10ppm;负载电容:10pF;频率稳定度:±15ppm;; LCSC Part Name: 8MHz ±10ppm 10pF; Supplier Part: C400090; Manufacturer: YJX(雅晶鑫); Supplier Footprint: SMD3225-4P; JLCPCB Part Class: 扩展库; Datasheet: https://atta.szlcsc.com/upload/public/pdf/source/20190626/C400090_CF95B89E745AFE4EF2E392EF8AC009D6.pdf; Supplier: LCSC; Type: 贴片晶振; Normal temperature Frequency Tolerance: ±10ppm; Load Capacitance: 10pF; Frequency Stability: ±15ppm; Equivalent Series Resistance(ESR): 250Ω; Operating Temperature: -40℃~+85℃
C5 C11-C14 C19 C21-C25 C27 C28 C394-C397 = CL10A225KP8NNNC: 容值:2.2uF;精度:±10%;额定电压:10V;材质(温度系数):X5R;; LCSC Part Name: 2.2uF ±10% 10V; Supplier Part: C1607; Manufacturer: SAMSUNG(三星); Supplier Footprint: 0603; JLCPCB Part Class: Extended Part; Datasheet: https://atta.szlcsc.com/upload/public/pdf/source/20160218/1457707763339.pdf; Supplier: LCSC; Tolerance: ±10%; Voltage Rated: 10V; Temperature Coefficient: X5R
C6 C18 C391-C393 = CL10A226MQ8NRNC: 容值:22uF;精度:±20%;额定电压:6.3V;材质(温度系数):X5R;; LCSC Part Name: 22uF ±20% 6.3V; Supplier Part: C59461; Manufacturer: SAMSUNG(三星); Supplier Footprint: 0603; JLCPCB Part Class: Basic Part; Datasheet: https://atta.szlcsc.com/upload/public/pdf/source/20160218/1457707763339.pdf; Supplier: LCSC; Tolerance: ±20%; Voltage Rated: 6.3V; Temperature Coefficient: X5R
C15 C16 = CL10A106KP8NNNC: 容值:10uF;精度:±10%;额定电压:10V;材质(温度系数):X5R;; LCSC Part Name: 10uF ±10% 10V; Supplier Part: C19702; Manufacturer: SAMSUNG(三星); Supplier Footprint: 0603; JLCPCB Part Class: 基础库; Datasheet: https://atta.szlcsc.com/upload/public/pdf/source/20160103/1457707703378.pdf; Supplier: LCSC; Tolerance: ±10%; Voltage Rated: 10V; Temperature Coefficient: X5R
C17 = CL10B104KB8NNNC: 容值:100nF;精度:±10%;额定电压:50V;材质(温度系数):X7R;; LCSC Part Name: 100nF ±10% 50V; Supplier Part: C1591; Manufacturer: SAMSUNG(三星); Supplier Footprint: 0603; JLCPCB Part Class: Extended Part; Datasheet: https://atta.szlcsc.com/upload/public/pdf/source/20160218/1457707763339.pdf; Supplier: LCSC; Tolerance: ±10%; Voltage Rated: 50V; Temperature Coefficient: X7R
C20 = CL10A105KO8NNNC: 容值:1uF;精度:±10%;额定电压:16V;材质(温度系数):X5R;; LCSC Part Name: 1uF ±10% 16V; Supplier Part: C1592; Manufacturer: SAMSUNG(三星); Supplier Footprint: 0603; JLCPCB Part Class: Extended Part; Datasheet: https://atta.szlcsc.com/upload/public/pdf/source/20220919/9FBE606BE0D9532D730F292EB26DC5BB.pdf; Supplier: LCSC; Tolerance: ±10%; Voltage Rated: 16V; Temperature Coefficient: X5R
C26 = CL10A475KP8NNNC: 容值:4.7uF;精度:±10%;额定电压:10V;材质(温度系数):X5R;; LCSC Part Name: 4.7uF ±10% 10V; Supplier Part: C1705; Manufacturer: SAMSUNG(三星); Supplier Footprint: 0603; JLCPCB Part Class: Extended Part; Datasheet: https://atta.szlcsc.com/upload/public/pdf/source/20160218/1457707763339.pdf; Supplier: LCSC; Tolerance: ±10%; Voltage Rated: 10V; Temperature Coefficient: X5R
L1 L2 L4 L5 L8 = 1uH: Supplier: LCSC; Manufacturer: chilisin(奇力新); Manufacturer Part: HEI201610K-1R0M-Q8DG; Supplier Part: C329576; JLCPCB Part Class: Extended Part; link: https://so.szlcsc.com/global.html?k=C329576&amp;ref=editor
LED2 = NCD0402R1: 发光颜色:红色;正向电压(VF):1.6V~2.6V;功率:65mW;正向电流:5mA;主波长:615nm~635nm;透镜颜色:无色透明透镜;发光强度:13mcd~30mcd;发光角度:130°;工作温度:-30℃~+85℃;; Supplier Part: C130719; Manufacturer: 国星光电; Supplier Footprint: 0402; JLCPCB Part Class: 扩展库; Datasheet: https://atta.szlcsc.com/upload/public/pdf/source/20200820/C130719_A72EA5A7FEC83C35856EA0453E4EE775.pdf; Supplier: LCSC; Emitted Color: 红色; Forward Voltage (VF): 1.6V~2.6V; Power Dissipation: 65mW; Forward Current: 5mA; Dominant Wavelength: 615nm~635nm; Lens Color: 无色透明透镜; Luminous Intensity: 13mcd~30mcd; Viewing Angle: 130°; Operating Temperature: -30℃~+85℃
R4 R50 = 0402WGF2200TCE: 电阻类型:厚膜电阻;阻值:220Ω;精度:±1%;功率:62.5mW;温度系数:±100ppm/℃;最大工作电压:50V;工作温度范围:-55℃~+155℃;; LCSC Part Name: 220Ω ±1% 62.5mW; Supplier Part: C25091; Manufacturer: UNI-ROYAL(厚声); Supplier Footprint: 0402; JLCPCB Part Class: 基础库; Datasheet: https://atta.szlcsc.com/upload/public/pdf/source/20200306/C422600_1E6D84923E4A46A82E41ADD87F860B5C.pdf; Supplier: LCSC; Type: 厚膜电阻; Tolerance: ±1%; Power(Watts): 62.5mW; Temperature Coefficient: ±100ppm/℃; Overload Voltage (Max): 50V; Operating Temperature Range: -55℃~+155℃
R51 = 0603WAF0000T5E: 电阻类型:厚膜电阻;阻值:0Ω;精度:±1%;功率:100mW;最大工作电压:75V;; LCSC Part Name: 0Ω ±1% 100mW 厚膜电阻; Supplier Part: C21189; Manufacturer: UNI-ROYAL(厚声); Supplier Footprint: 0603; JLCPCB Part Class: 基础库; Datasheet: https://atta.szlcsc.com/upload/public/pdf/source/20200306/C422600_1E6D84923E4A46A82E41ADD87F860B5C.pdf; Supplier: LCSC; Type: 厚膜电阻; Tolerance: ±1%; Power(Watts): 100mW; Overload Voltage (Max): 75V; Operating Temperature Range: -55℃~+155℃
U33 U36 = WAFER-SH1.0-2PWB: 插针结构:1x2P;间距:1mm;安装方式:卧贴;参考系列:SH;总PIN数:2P;排数:1;每排PIN数:2;行距:-;额定电流:1A;触头材质:黄铜;触头镀层:-;工作温度:-25℃~+85℃;; LCSC Part Name: 1x2P 间距:1mm 卧贴 系列:SH; Supplier Part: C3029341; Manufacturer: XUNPU(讯普); Supplier Footprint: SMD,P=1mm,卧贴; JLCPCB Part Class: 扩展库; Datasheet: https://atta.szlcsc.com/upload/public/pdf/source/20220527/1879B8210BD3B2006BCEAC1A40D397B6.pdf; Supplier: LCSC; Pins Structure: 1x2P; Pitch: 1mm; Mounting Type: 卧贴; Reference Series: SH; Number of Pins: 2P; Number of Rows: 1; Number of PINs Per Row: 2; Current Rating: 1A; Contact Material: 黄铜; Operating Temperature: -25℃~+85℃; Voltage Rating: 50V; Plastic Material: LCP; Supplementary Features: 辅助焊脚; Color: 米色; Z-Height of the Board: 3.15mm; X-Length of Bottom Edge on Board (Spacing Line): 4.35mm; Y-Width of Bottom Edge on Board: 5.05mm
U34 = AXP2101: A PMU designed by Allwinner; Supplier Part: C3036461; Manufacturer: x-powers; Supplier Footprint: QFN-40-EP(5x5); JLCPCB Part Class: Extended Part; Datasheet: https://atta.szlcsc.com/upload/public/pdf/source/20230506/27D868F447993329A9E953603DF31964.pdf; Supplier: LCSC
C349 C400 = CL05B103KB5NNNC: 容值:10nF;精度:±10%;额定电压:50V;材质(温度系数):X7R;; LCSC Part Name: 10nF ±10% 50V; Supplier Part: C15195; Manufacturer: SAMSUNG(三星); Supplier Footprint: 0402; JLCPCB Part Class: 基础库; Datasheet: https://atta.szlcsc.com/upload/public/pdf/source/20160218/1457707763339.pdf; Supplier: LCSC; Tolerance: ±10%; Voltage Rated: 50V; Temperature Coefficient: X7R
C352 C353 = TAJA106K016RNJ: 容值:10uF;精度:±10%;额定电压:16V;等效串联电阻(ESR):3Ω@100kHz;; LCSC Part Name: 10uF ±10% 16V; Supplier Part: C7171; Manufacturer: Kyocera AVX; Supplier Footprint: CASE-A-3216-18(mm); JLCPCB Part Class: 基础库; Supplier: LCSC; Tolerance: ±10%; Voltage Rating: 16V; Equivalent Series Resistance(ESR): 3Ω@100kHz; Operating Temperature: -55℃~+125℃
CN2 = PJ-342_C668606: 连接器类型:3.5mm耳机座;额定电流:500mA;额定电压:30V;触头材质:铜;触头镀层:金;工作温度范围:-30℃~+70℃;; LCSC Part Name: 3.5mm耳机座; Supplier Part: C668606; Manufacturer: SHOU HAN(首韩); Supplier Footprint: SMD; JLCPCB Part Class: 扩展库; Datasheet: https://atta.szlcsc.com/upload/public/pdf/source/20200618/C668606_D9051A7D9D1D8CCDEAA76A8E7BC279ED.pdf; Supplier: LCSC; Connector Type: 3.5mm耳机座; Current Rating (Max): 500mA; Voltage Rating (Max): 30V; Contact Material: 铜; Contact Plating: 金; Operating Temperature Range: -30℃~+70℃
Q5 = AO3401A_C15127: 类型:1个P沟道;漏源电压(Vdss):30V;连续漏极电流(Id):4A;导通电阻(RDS(on)@Vgs,Id):44mΩ@10V,4.3A;功率(Pd):1.4W;阈值电压(Vgs(th)@Id):1.3V@250uA;; LCSC Part Name: 1个P沟道 耐压:30V 电流:4A; Supplier Part: C15127; Manufacturer: AOS; Supplier Footprint: SOT-23; JLCPCB Part Class: 基础库; Datasheet: https://atta.szlcsc.com/upload/public/pdf/source/20160507/1462613609053.pdf; Supplier: LCSC; Type: 1个P沟道; Drain Source Voltage (Vdss): 30V; Continuous Drain Current (Id): 4A; Drain Source On Resistance (RDS(on)@Vgs,Id): 44mΩ@10V,4.3A; Power Dissipation (Pd): 1.4W; Gate Threshold Voltage (Vgs(th)@Id): 1.3V@250uA; Total Gate Charge (Qg@Vgs): 12.2nC@4.5V; Input Capacitance (Ciss@Vds): 1.2nF@15V; Operating Temperature: -55℃~+150℃@(Tj)
R27 R29 = 0402WGF1003TCE: 电阻类型:厚膜电阻;阻值:100kΩ;精度:±1%;功率:62.5mW;最大工作电压:50V;温度系数:±100ppm/℃;; LCSC Part Name: 100kΩ ±1% 62.5mW 厚膜电阻; Supplier Part: C25741; Manufacturer: UNI-ROYAL(厚声); Supplier Footprint: 0402; JLCPCB Part Class: 基础库; Datasheet: https://atta.szlcsc.com/upload/public/pdf/source/20200306/C422600_1E6D84923E4A46A82E41ADD87F860B5C.pdf; Supplier: LCSC; Type: 厚膜电阻; Tolerance: ±1%; Power(Watts): 62.5mW; Overload Voltage (Max): 50V; Temperature Coefficient: ±100ppm/℃; Operating Temperature Range: -55℃~+155℃
R28 = 0402WGF1004TCE: 电阻类型:厚膜电阻;阻值:1MΩ;精度:±1%;功率:62.5mW;最大工作电压:50V;温度系数:±100ppm/℃;; LCSC Part Name: 1MΩ ±1% 62.5mW 厚膜电阻; Supplier Part: C26083; Manufacturer: UNI-ROYAL(厚声); Supplier Footprint: 0402; JLCPCB Part Class: 基础库; Datasheet: https://atta.szlcsc.com/upload/public/pdf/source/20200306/C422600_1E6D84923E4A46A82E41ADD87F860B5C.pdf; Supplier: LCSC; Type: 厚膜电阻; Tolerance: ±1%; Power(Watts): 62.5mW; Overload Voltage (Max): 50V; Temperature Coefficient: ±100ppm/℃; Operating Temperature Range: -55℃~+155℃
R35-R37 = RC0402FR-0730KL: 电阻类型:厚膜电阻;阻值:30kΩ;精度:±1%;功率:62.5mW;最大工作电压:50V;温度系数:±100ppm/℃;; LCSC Part Name: 厚膜电阻 30kΩ ±1% 62.5mW; Supplier Part: C138008; Manufacturer: YAGEO(国巨); Supplier Footprint: 0402; JLCPCB Part Class: 扩展库; Datasheet: https://atta.szlcsc.com/upload/public/pdf/source/20181009/C309620_DA5935B6E1D48212CB7A533FE518B3C2.pdf; Supplier: LCSC; Type: 厚膜电阻; Tolerance: ±1%; Power(Watts): 62.5mW; Overload Voltage (Max): 50V; Temperature Coefficient: ±100ppm/℃; Operating Temperature Range: -55℃~+155℃
R58 = ERA2AEB431X: 电阻类型:薄膜电阻;阻值:430Ω;精度:±0.1%;功率:63mW;温度系数:±25ppm/℃;; LCSC Part Name: 430Ω ±0.1% 63mW 薄膜电阻; Supplier Part: C445589; Manufacturer: PANASONIC(松下); Supplier Footprint: 0402; JLCPCB Part Class: 扩展库; Supplier: LCSC; Type: 薄膜电阻; Tolerance: ±0.1%; Power(Watts): 63mW; Temperature Coefficient: ±25ppm/℃; Operating Temperature Range: -55℃~+155℃
U12 = VS1053B-L: MP3芯片; Supplier Part: C9922; Manufacturer: VLSI; Supplier Footprint: LQFP-48(7x7); JLCPCB Part Class: 扩展库; Datasheet: https://atta.szlcsc.com/upload/public/pdf/source/20121114/1457706558124.pdf; Supplier: LCSC
U23 = NS4150B_C189961: 功放类型:D类功放;输出功率:3Wx1@4Ω;; Supplier Part: C189961; Manufacturer: Nsiway(纳芯威); Supplier Footprint: MSOP-8; JLCPCB Part Class: 扩展库; Datasheet: https://atta.szlcsc.com/upload/public/pdf/source/20220916/DAE631F3909B9CBB38BDE76E3E6D5896.pdf; Supplier: LCSC; Type of Power Amplifier: D类功放; Output Power: 3Wx1@4Ω; Supply Voltage: 3V~5.25V
X3 = TXM12.288M0004322FBCDO00T: 晶振类型:贴片晶振;频率:12.288MHz;常温频差:±10ppm;负载电容:12pF;频率稳定度:±20ppm;; LCSC Part Name: 12.288MHz ±10ppm 12pF; Supplier Part: C362472; Manufacturer: YJX(雅晶鑫); Supplier Footprint: SMD3225-4P; JLCPCB Part Class: 扩展库; Datasheet: https://atta.szlcsc.com/upload/public/pdf/source/20190124/C362472_6389399A35A00A0EF5120E191E77C846.pdf; Supplier: LCSC; Type: 贴片晶振; Normal temperature Frequency Tolerance: ±10ppm; Load Capacitance: 12pF; Frequency Stability: ±20ppm; Equivalent Series Resistance(ESR): 60Ω; Operating Temperature: -40℃~+85℃

## Nets
GND: C4.2 C5.2 C6.2 C11.2 C12.2 C13.2 C14.2 C15.2 C16.2 C17.1 C18.1 C19.1 C20.1 C21.1 C22.1 C23.1 C24.1 C25.1 C26.1 C27.1 C28.1 C34.1 C35.1 C36.1 C342.1 C343.1 C346.1 C347.1 C348.2 C349.2 C350.1 C351.1 C359.1 C361.1 C367.1 C368.1 C369.1 C370.1 C371.1 C372.1 C373.1 C374.1 C375.1 C376.1 C377.1 C378.1 C379.1 C383.2 C384.2 C385.2 C391.2 C392.2 C393.2 C394.2 C395.2 C396.2 C397.2 C398.1 C400.1 C402.1 C403.1 CARD2.6(VSS) CARD2.10(GND) CARD2.11(GND) CARD2.12(GND) CARD2.13(GND) CN5.1 CN5.5 CN5.6 FPC1.1 FPC1.6 FPC1.7 FPC1.8 lcd1.5 lcd1.34 lcd1.38 lcd1.39 Q1.2(E) Q5.2(S) R3.2 R4.2 R7.1 R29.1 R56.1 R57.2 touch1.6 touch1.7 touch1.8 U2.24(VSS) U2.49(VSS) U2.78(VSS) U2.79(VREFN) U2.96(VSS) U6.2(A&apos;) U10.1 U11.1 U12.4(DGND0) U12.16(DGND1) U12.20(DGND2) U12.21(DGND3) U12.22(DGND4) U12.35(GND) U12.37(AGND0) U12.40(AGND1) U12.41(AGND2) U12.47(AGND3) U23.7(GND) U29.4(GND) U32.1 U33.1 U33.3 U33.4 U34.3(GND) U34.41(EPAD) U35.4(GND) U36.3 U36.4 U37.1 U38.1 USBC1.0 USBC1.A1(GND) USBC1.A12(GND) USBC1.B1(GND) USBC1.B12(GND) X2.2 X2.4 X3.2(GND) X3.4(GND)
VBAT: C19.2 C361.2 U23.6(VCC) U33.2 U34.33(VBAT)
VBUS: C16.1 U34.37(VBUS) USBC1.A4(VBUS) USBC1.A9(VBUS) USBC1.B4(VBUS) USBC1.B9(VBUS)
ALDO1: C22.2 C346.2 U12.5(CVDD0) U12.7(CVDD1) U12.24(CVDD2) U12.31(CVDD3) U34.18(ALDO1)
ALDO2: C23.2 U34.19(ALDO2)
ALDO3: C24.2 C349.1 FPC1.2 FPC1.5 R51.1 U12.38(AVDD0) U12.43(AVDD1) U12.45(AVDD2) U34.16(ALDO3)
ALDO4: C25.2 U34.15(ALDO4)
AUDIO_KEY: Q5.1(G) U2.1(PF0/UART0_RX/LPUART0_RX/EPSC_NBL2/COMP0_OUT)
BL: R6.1 U2.88(PE7(WKUP7)/ANATST/SPI2_SSN/GPT1_ETR/LPT_CH2/ADC_INA0)
BLDO1: C27.2 U34.12(BLDO1)
BLDO2: C28.2 U34.14(BLDO2)
BLDOIN: C26.2 U34.13(BLDOIN)
CE: U2.52(PC1/GPT2_CH1/GPT2_ETR/UART2_RX/SPI3_SSN) U29.5(CE)
CHGLED: LED2.1(K) U34.1(CHGLED)
CLK: CARD2.5(CLK) R25.1 U2.27(PB1/ATIM1_CH1N/SCLA0/SPI0_SCK/EPSC_A10)
CPUS_LDO: C11.1 U34.10(CPUSLDO)
CS: CARD2.2(CD/DATA3) U2.26(PB0(WKUP1)/ATIM1_CH4N/SMBA0/SPI0_SSN/EPSC_A9)
DB0: lcd1.1 U2.36(PB10/QSPI_IO2/EPSC_DO/ATIM0_CH2/UART1_RTS)
DB1: lcd1.2 U2.37(PB11/QSPI_IO3/EPSC_D1/EPWM3A/UART1_RTS)
DB2: lcd1.3 U2.56(PC5(WKUP6)/SPI4_SSN/EPSC_D2/ATIM0_CH4N)
DB3: lcd1.4 U2.57(PC6/SPI4_SCK/EPSC_D3/FDCAN_RX)
DB4: lcd1.22 U2.12(PA9/ATIM0_BKIN/ATIM0_ETR/SDAA0/EPSC_D4)
DB5: lcd1.35 U2.13(PA10/ATIM0_CHIN/EPSC_D5/SCL0)
DB6: lcd1.36 U2.14(PA11/ATIM0_CH1/EPSC_D6/SDA0)
DB7: lcd1.37 U2.15(PA12/ATIM0_CH2N/QSPI_CLK/EPSC_D7)
DB8: lcd1.23 U2.16(PA13/ATIM0_CH2/MCLK0/QSPI_NCS/EPSC_D8)
DB9: lcd1.24 U2.17(PA14/ATIM0_CH3N/SPI0_SSN/QSPI_IO0/EPSC_D9)
DB10: lcd1.25 U2.18(PA15/ATIM0_CH3/SPI0_SCK/QSPI_IO1/EPSC_D10)
DB11: lcd1.26 U2.19(PE14/ATIM0_CH4N/SPI0_MISO/QSPI_IO2/EPSC_D11)
DB12: lcd1.27 U2.20(PE15/ATIM0_CH4/SPI0_MOSI/QSPI_IO3/EPSC_D12)
DB13: lcd1.28 U2.21(PF2/UART2_RX/EPSC_D13/EPWM_BK1)
DB14: lcd1.29 U2.22(PF3/UART2_TX/EPSC_D14/EPWM_BK2)
DB15: lcd1.30 U2.23(PF4/COMP2_OUT/EPSC_D15/LPT_CH1/EPWM_BK3)
DC1SW: C395.1 U34.20(DLDO1/DC1SW)
DC4SW: C12.1 U34.11(DLDO2/DC4SW)
DCDC1: C342.2 C343.2 C347.2 C367.2 C368.2 C369.2 C370.2 C371.2 C372.2 C373.2 C374.2 C375.2 C376.2 C377.2 C391.1 C398.2 CARD2.4(VDD) CN5.4 L1.2 lcd1.6 lcd1.16 lcd1.32 lcd1.33 R1.2 R2.2 R8.1 R18.2 R21.2 R22.2 R23.2 R24.2 R25.2 R26.2 R27.2 R37.2 R42.2 R51.2 R52.2 R55.1 R59.2 R60.2 touch1.1 U2.25(VDD) U2.50(VDD) U2.80(VREFP) U2.81(VDD) U2.97(VDD) U11.2 U12.6(IOVDD0) U12.14(IOVDD1) U12.19(IOVDD2) U12.32(XTEST) U29.1(VCC2) U32.2 U34.21(FB1) U35.3(WP#(IO2)) U35.7(HOLD#orRESET#(IO3)) U35.8(VCC)
DCDC2: C392.1 L2.2 U34.26(FB2)
DCDC3: C6.1 L8.2 U34.4(FB3)
DCDC4: C393.1 L4.2 U34.9(FB4)
DCDC5/VSYS: C17.2 C18.2 L5.1
DCDC5_FB: U34.32(GPIO1)
FLASH_CLK: U2.53(PC2/SPI3_SCLK/UART5_TX/ATIM0_CH1N) U35.6(CLK)
FLASH_CS: R55.2 U2.58(PC7/MCLK4/FDCAN_TX/EPSC_NE2) U35.1(CS#)
FLASH_MISO: U2.54(PC3/SPI3_MISO/UART5_RX/ATIM0_CH2N) U35.2(DO(IO1))
FLASH_MOSI: U2.55(PC4/SPI3_MOSI/UART2_TX/ATIM0_CH3N) U35.5(DI(IO0))
GBUF: CN2.3 U12.42(GBUF)
GPIO: R29.2 U12.33(GPIO0) U12.34(GPIO1)
I/O: R42.1 U2.51(PC0/LPT_CH2/SMBA2/UART4_RX/EPSC_A3) U29.6(I/O)
IM0: lcd1.11 R3.1 R52.1
IRQ: U34.38(IRQ)
LCD_CS: lcd1.7 U2.44(PE10/EPWM1B/SPI2_SSN/UART3_RX/EPSC_NE4)
LCD_RD: lcd1.10 U2.60(PC9/SPI4_MOSI/EPSC_NOE/FDCAN_RX)
LCD_RS: lcd1.8 U2.66(PC15/ATIM1_BRK2/SCL0/UART7_TX/EPSC_A6)
LCD_RST: lcd1.31 U2.65(PC14/LPT_CH1/SMBA2/SPI3_MOSI/ATIM1_BKIN)
LCD_WR: lcd1.9 U2.61(PC10/UART6_TX/EPSC_NWE/FSCAN_RX)
LED_K: lcd1.17 lcd1.18 lcd1.19 lcd1.20 R5.2
LEFT: C352.2 CN2.5
LINE: C400.2 R58.1 U12.1(MICPLINE1)
MICN: FPC1.3 FPC1.4 U12.2(MICN)
MISO: CARD2.7(DAT0) R24.1 U2.28(PB2/ATIM1_CH2N/SDAA0/SPI0_MISO/EPSC_A11)
MOSI: CARD2.3(CMD) R26.1 U2.29(PB3/ATIM1_CH3N/SPI0_MOSI/EPSC_A12)
MP3_LEFT: C352.1 C358.1 U12.46(LEFT)
MP3_RIGHT: C353.1 U12.39(RIGHT)
PA0: U2.3(PA0(WKUP0)/GPT2_CH4/SPI1_SSN/ADC_INB0)
PA1: U2.4(PA1/GPT2_CH1/GPT2_ETR/SPI1_SCK/ADC_INB1) U12.28(SCLK)
PA2: U2.5(PA2/UART0_RTS/ATIM0_BRK2/SPI1_MISO/ADC_INB2/OPA1_INP) U12.30(SO)
PA3: U2.6(PA3/UART0_CTS/SCLA0/SPI1_MOSI/ADC_INB3/OPA1_INN) U12.29(SI)
PA4: U2.7(PA4/UART0_TX/MCLK1/ADC_INB4/COMP0_INN/LUT3_OUT) U12.23(XCS)
PA5: U2.8(PA5/UART0_RX/ADC_INB5/COMP2_INN/LUT2_OUT) U12.13(XDCSBSYNC1)
PA6: U2.9(PA6/SPI1_SSN/GPT2_CH2/ADC_INB8/OPA1_OUT) U12.8(DREQ)
PA7: U2.10(PA7/GPT2_CH3/ADC_INB7/COMP1_INN/FDCAN_RX/UART1_RX) U12.3(XRESET)
PA8: U2.11(PA8(WKUP4)/SMBA0/FDCAN_TX/UART1_TX)
PB4: U2.30(PB4/QSPI_CLK/ATIM1_CH4/FDCAN_RX/EPSC_A13)
PB5: U2.31(PB5/QSPI_NCS/ATIM1_CH1/FDCAN_TX/EPSC_A14)
PB6: U2.32(PB6/MCLK0/QSPI_IO0/ATIM1_CH2/EPSC_A15)
PB7: U2.33(PB7/SMBA1/QSPI_IO1/EPSC_A16/ATIM1_CH3)
PB8: R2.1 touch1.4 U2.34(PB8/SCLA1/EPSC_A17/ATIM0_CH3)
PB9: touch1.5 U2.35(PB9/SDAA1/EPSC_A18/ATIM0_CH1)
PB12: U2.38(PB12/EPWM3B/UART1_RX/LPUART1_RX/EPSC_A0)
PB13: U2.39(PB13/EPWM2A/UART1_TX/LPUART1_TX/EPSC_A1)
PB14: U2.40(PB14/EPWM2B/FSCAN_RX/EPSC_A2)
PB15: touch1.3 U2.41(PB15(WKUP5)/EPWM0A/SCL1/EPSC_A8)
PC8: U2.59(PC8/SPI4_MISO/EPSC_CLK/FDCAN_TX)
PC11: U2.62(PC11/UART6_RX/SPI3_MOSI/EPSC_NWAIT/FSCAN_TX)
PC12: U2.63(PC12/SCLA2/SPI3_SCK/EPSC_A4)
PC13: U2.64(PC13/SDAA2/SPI3_MISO/EPSC_A5)
PD0: U2.89(PD0/FOUT0/SCLA1/SPI2_SCK/ADC_INA1)
PD1: U2.90(PD1/SPI2_MOSI/SDAA1/ADC_INA2/COMP0_INP)
PD2: U2.91(PD2/GPT1_CH4/SPI2_MISO/SMBA1/ADC_INA3/COMP1_INP)
PD3: U2.92(PD3(WKUP3)/LPT_ETR/SPI2_MOSI/ADC_INA4/COMP2_INP)
PD4: U2.93(PD4/GPT1_CH1/ATIM1_ETR/SPI1_MISO/ADC_INA5/OPA0_INP)
PD5: U2.94(PD5/GPT1_CH2/SPI1_SCK/ADC_INA6/OPA0_INN)
PD6: U2.95(PD6/GPT1_CH3/SPI1_MOSI/ADC_INA8/OPA0_OUT)
PD9: U2.67(PD9/SDA0/UART7_RX/EPSC_NL/SVS)
PD10: U2.68(PD10(WKUP2)/LPUART0_TX/DAC1_OUT1/EPSC_A7/LOUT0_OUT)
PD11: U2.69(PD11/TRACEDATA3/MCLK3/EPSC_NBL0/DAC0_OUT2/LOUT1_OUT)
PD12: U2.70(PD12/TRACEDATA2/SPI3_SSN/LPUART0_RX/EPSC_NBL1)
PE0: C4.1 U2.72(PE0/XTHIN) X2.3
PE1: C385.1 U2.73(PE1/XTHOUT) X2.1
PE2: C402.2 R60.1 U2.83(PE2/TRACEDATA0/GPT0_ETR/EPSC_A23) U38.2
PE3: C403.2 R59.1 U2.84(PE3/TRACECLK/GPT0_CH1/UART2_RTS/EPSC_A19) U37.2
PE4: U2.85(PE4/JTDO_SWO/GPT0_CH2/UART2_CTS/EPSC_A20)
PE5: U2.86(PE5/JTRSTN/GPT0_CH3/UART3_RTS/EPSC_A21/ADC_INB6)
PE6: U2.87(PE6/JTDI/GPT0_CH4/UART3_CTS/EPSC_A22/ADC_INA7)
PE8: R1.1 touch1.2 U2.42(PE8/FOUT1/EPWM0B/SDA1/MCLK2)
PE9: U2.43(PE9/EPWM1A/SPI2_SCK/UART3_TX/EPSC_NE3)
PE11: U2.45((DM)PE11/ATIM0_CH4/ATIM0_BRK2/SPI2_MISO) USBC1.A7(DN1) USBC1.B7(DN2)
PE12: U2.46((DP)PE12/ATIM0_ETR/SPI2_MOSI) USBC1.A6(DP1) USBC1.B6(DP2)
PE13: U2.47(PE13/FOUT2/UART4_TX/MCLK3/FSCAN_TX/ANATST) U29.7(SCLK)
PF1: U2.2(PF1/UART0_TX/LPUART0_TX/EPSC_NBL3/COMP1_OUT)
PF5: U2.71(PF5/TRACEDATA1/EPSC_NE1/DAC0_OUT1)
PWROK: U34.29(PWROK)
PWRON: U10.2 U34.30(PWRON)
RIGHT: C353.2 CN2.4
RST: C34.2 R18.1 U2.100(NRST) U6.1(A)
RTC: U2.74(PH15/RTCOUT/TAMPER)
SCK: U34.40(SCK)
SDA: U34.39(SDA)
SWCLK: CN5.2 R22.1 U2.98(PD7/SWCLK_JTCK/UART3_RX/LPUART1_RX/EPSC_A24)
SWDIO: CN5.3 R21.1 U2.99(PD8/SWDIO_JTMS/UART3_TX/LPUART1_TX/EPSC_A25)
TS: R4.1 U34.31(TS)
VBACKUP: C14.1 U34.27(VBACKUP)
VCAP: R19.2 U2.77(VCAP)
VCAP_1: R20.2 U2.48(VCAP_1)
VRTC: C13.1 U29.8(VCC1) U34.28(RTCLDO)
VSYS: C5.1 C15.1 C21.2 C394.1 C396.1 C397.1 R50.1 U34.6(VIN3) U34.7(VIN4) U34.17(ALDOIN) U34.23(VIN1) U34.24(VIN2) U34.34(VSYS) U34.36(VMID)
XL/X-: lcd1.14
XR/X+: lcd1.12
YD/Y+: lcd1.13
YU/Y-: lcd1.15
$1N8397: C384.1 U2.75(PH14/XT32KOUT) X1.2
$1N8398: C383.1 U2.76(PH13/XT32KIN) X1.1
$1N8586: C35.2 R19.1
$1N8587: C36.2 R20.1
$1N8688: CARD2.1(DATA2) CARD2.8(DAT1) R23.1
$1N9003: C378.2 U29.2(X1) X4.2
$1N9004: C379.2 U29.3(X2) X4.1
$1N13562: Q1.3(C) R5.1
$1N13566: Q1.1(B) R6.2 R7.2 R8.2
$1N19277: R56.2 USBC1.B5(CC2)
$1N19279: R57.1 USBC1.A5(CC1)
$2N1132: LED2.2(A) R50.2
$2N7324: L1.1 U34.22(LX1)
$2N7333: L2.1 U34.25(LX2)
$2N7338: L8.1 U34.5(LX3)
$2N7343: L4.1 U34.8(LX4)
$2N7384: L5.2 U34.35(SW)
$2N7386: C20.2 U34.2(VREF)
$3N2174: R27.1 U12.26(RX)
$3N2188: C350.2 R28.1 U12.17(XTALO) X3.1(OE#)
$3N2200: C348.1 U12.44(RCAP)
$3N2241: R36.2 U23.4(INN)
$3N2242: R35.2 U23.3(INP)
$3N2243: C359.2 R36.1
$3N2244: C358.2 R35.1
$3N2251: C360.1 U23.2(Bypass)
$3N2275: C351.2 R28.2 U12.18(XTALI) X3.3(OUT)
$3N5130: U23.5(VON) U36.1
$3N5134: U23.8(VoP) U36.2
$3N6131: C401.2 CN2.2
$3N6419: C401.1 R58.2
Net-(C360-2): C360.2 Q5.3(D) R37.1 U23.1(CTRL)

Not connected (* = marked no-connect by the designer): CARD2 9(CD)*; CN2 6* 7*; lcd1 21*; U2 82(VBAT)*; U12 9(GPIO2DCLK1)* 10(GPIO3SDATA1)* 11(GPIO6I2S_SCLK3)* 12(GPIO7I2S_SDATA3)* 15(VCO)* 25(GPIOI2S_MCLK3)* 27(TX)* 36(GPIO4I2S-LROUT3)* 48(LINE2)*; USBC1 A8(SBU1)* B8(SBU2)*

## Notes on the sheets
sheet 1
- SCREEN
- CORE
- TF_CARD
- Type-C 16Pin
- RTC
- flash
- USB
sheet 2
- PMIC
sheet 3
- 音频运放电路
- 硬件解码
